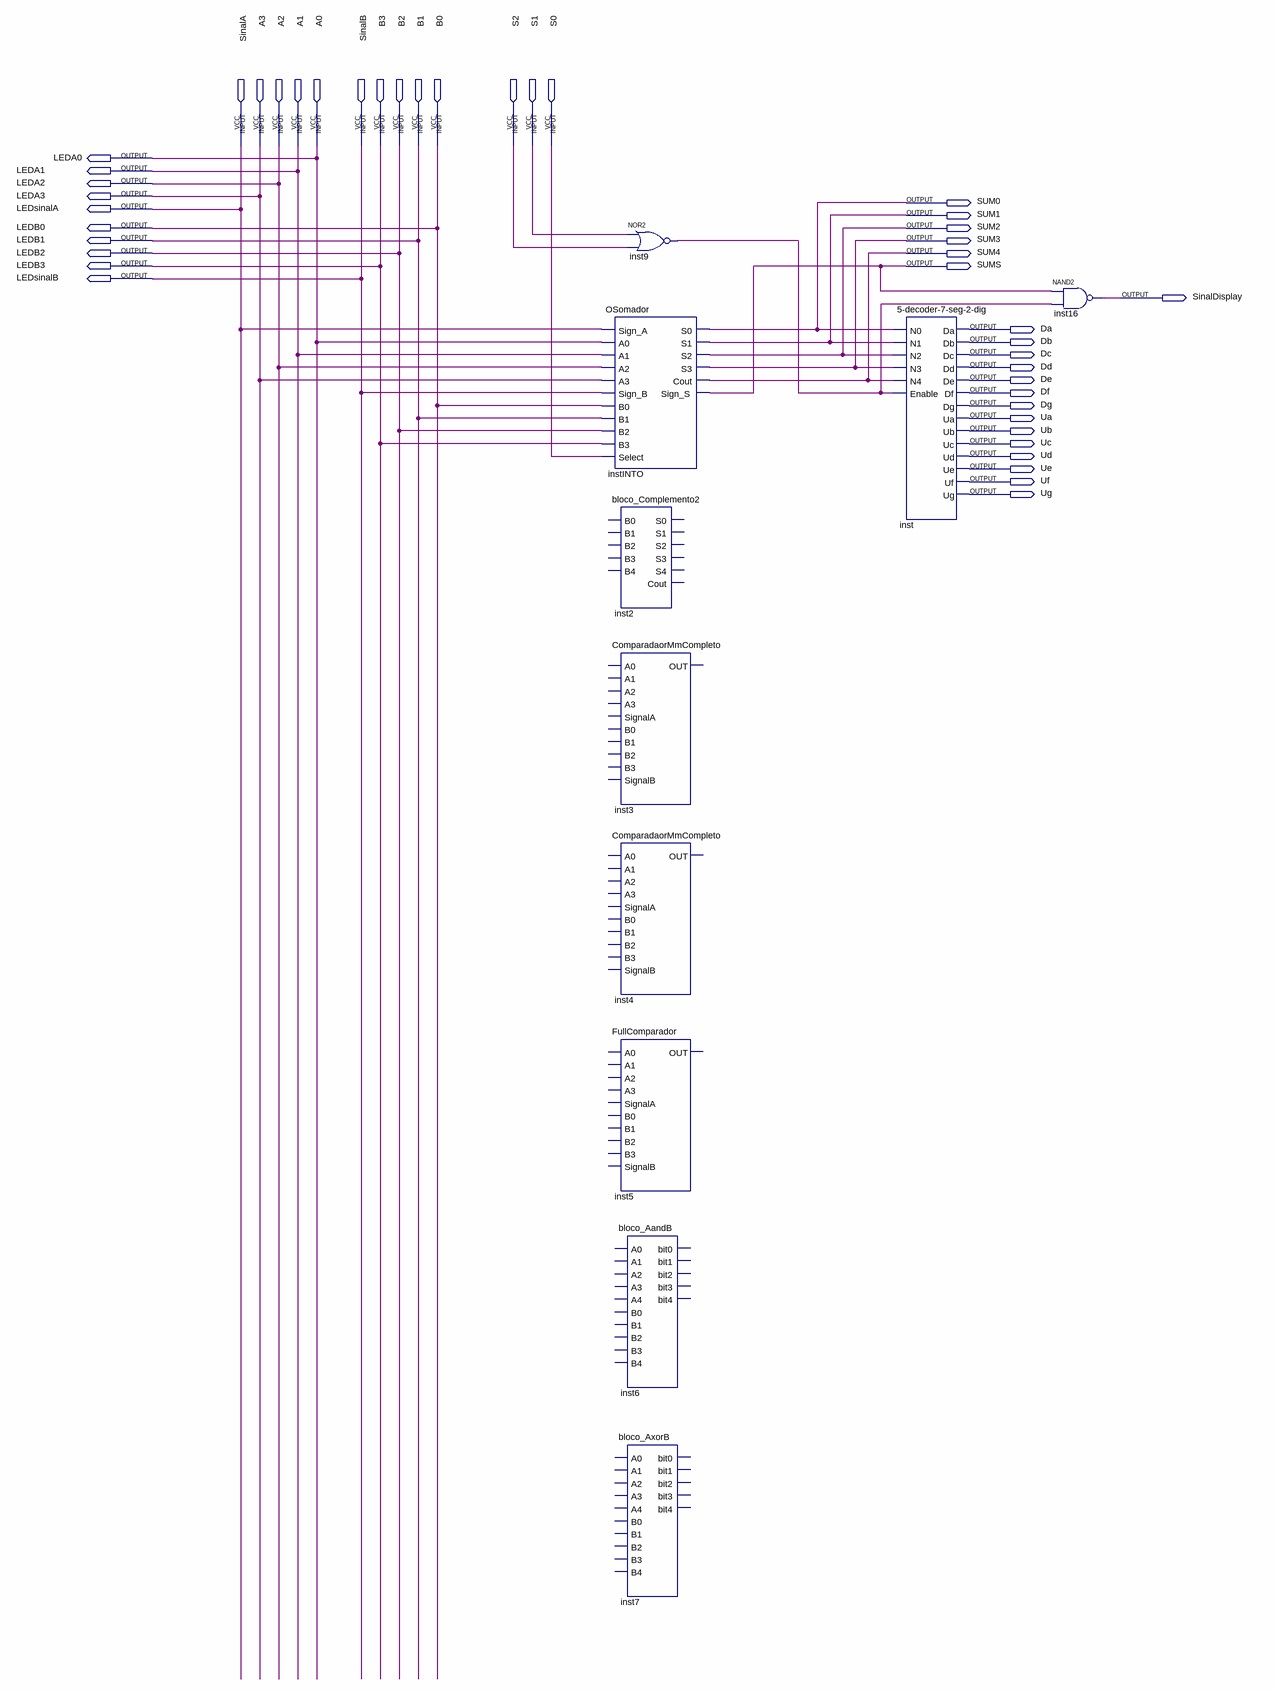
[diagram p0: schematic sheet]
// Quartus schematic Teste.bdf as structural Verilog: 10 symbols, 44 pins
module Teste (
  input  SinalA,
  input  A3,
  input  A2,
  input  A1,
  input  A0,
  input  SinalB,
  input  B3,
  input  B2,
  input  B1,
  input  B0,
  input  S2,
  input  S1,
  input  S0,
  output LEDA0,
  output LEDA1,
  output LEDA2,
  output LEDA3,
  output SUM0,
  output LEDsinalA,
  output SUM1,
  output LEDB0,
  output SUM2,
  output LEDB1,
  output SUM3,
  output LEDB2,
  output SUM4,
  output LEDB3,
  output SUMS,
  output LEDsinalB,
  output SinalDisplay,
  output Da,
  output Db,
  output Dc,
  output Dd,
  output De,
  output Df,
  output Dg,
  output Ua,
  output Ub,
  output Uc,
  output Ud,
  output Ue,
  output Uf,
  output Ug
);

  wire inst9_out;

  nor inst9 (inst9_out, S1, S2);
  OSomador instINTO (
    .Sign_A(SinalA), .A0(A0), .A1(A1), .A2(A2), .A3(A3), .Sign_B(SinalB), .B0(B0), .B1(B1), .B2(B2), .B3(B3),
    .Select(S0), .S0(SUM0), .S1(SUM1), .S2(SUM2), .S3(SUM3), .Cout(SUM4), .Sign_S(SUMS));
  bloco_Complemento2 inst2 ();  // open: B0, B1, B2, B3, B4, S0, S1, S2, S3, S4, Cout
  ComparadaorMmCompleto inst3 ();  // open: A0, A1, A2, A3, SignalA, B0, B1, B2, B3, SignalB, OUT
  ComparadaorMmCompleto inst4 ();  // open: A0, A1, A2, A3, SignalA, B0, B1, B2, B3, SignalB, OUT
  FullComparador inst5 ();  // open: A0, A1, A2, A3, SignalA, B0, B1, B2, B3, SignalB, OUT
  bloco_AandB inst6 ();  // open: A0, A1, A2, A3, A4, B0, B1, B2, B3, B4, bit0, bit1, bit2, bit3, bit4
  bloco_AxorB inst7 ();  // open: A0, A1, A2, A3, A4, B0, B1, B2, B3, B4, bit0, bit1, bit2, bit3, bit4
  \5-decoder-7-seg-2-dig  inst (
    .N0(SUM0), .N1(SUM1), .N2(SUM2), .N3(SUM3), .N4(SUM4), .Enable(inst9_out), .Da(Da), .Db(Db), .Dc(Dc),
    .Dd(Dd), .De(De), .Df(Df), .Dg(Dg), .Ua(Ua), .Ub(Ub), .Uc(Uc), .Ud(Ud), .Ue(Ue), .Uf(Uf), .Ug(Ug));
  nand inst16 (SinalDisplay, SUMS, inst9_out);

  assign LEDA0 = A0;
  assign LEDA1 = A1;
  assign LEDA2 = A2;
  assign LEDA3 = A3;
  assign LEDB0 = B0;
  assign LEDB1 = B1;
  assign LEDB2 = B2;
  assign LEDB3 = B3;
  assign LEDsinalA = SinalA;
  assign LEDsinalB = SinalB;
endmodule
